# EAGLE design diplom (EAGLE 7.1.0)
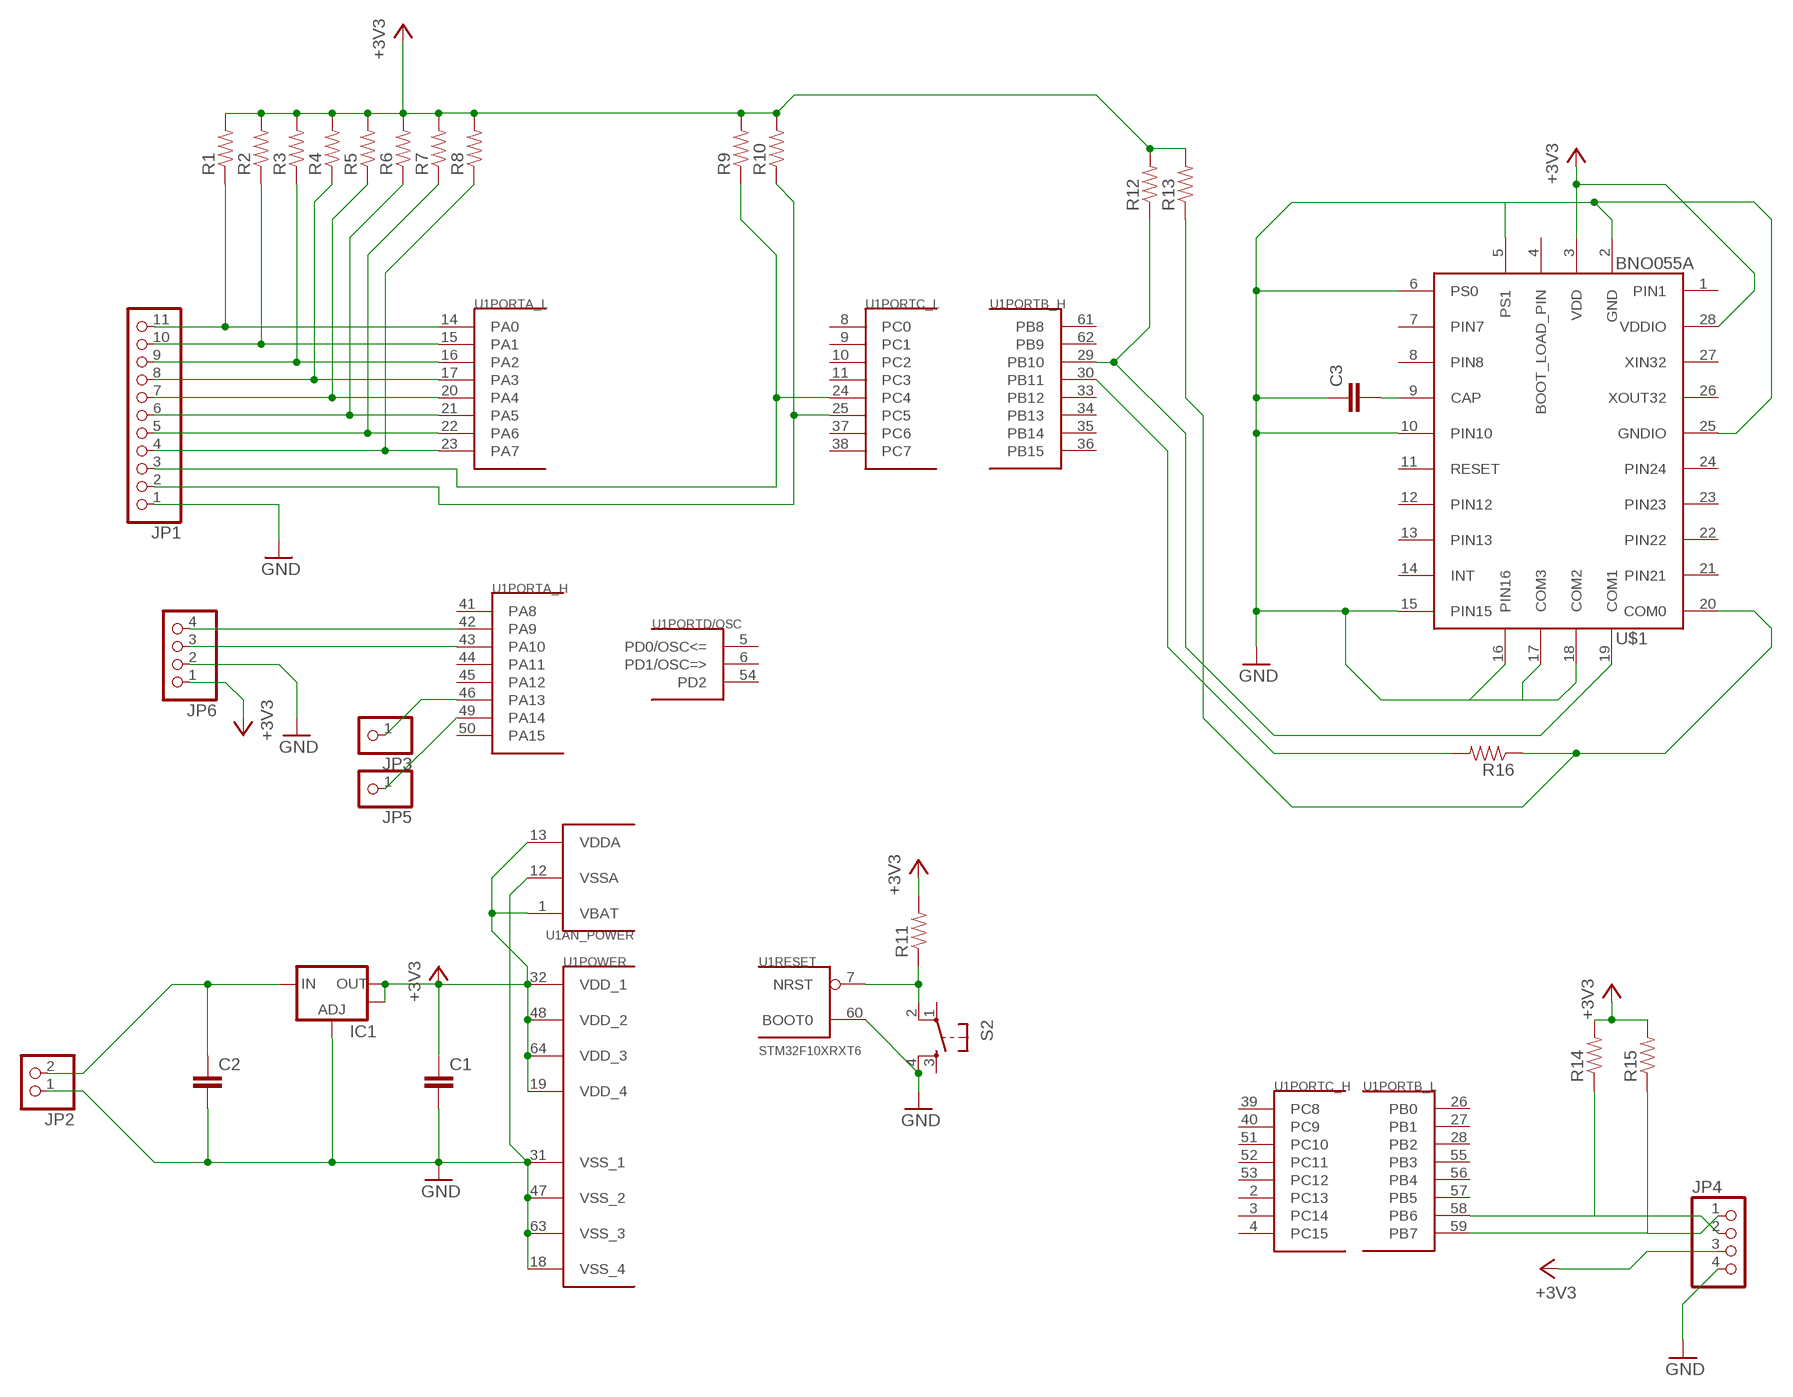
[diagram p0: schematic, sheet 1]

## Parts
C1  CAP1206  [1206]
C2  CAP1206  [1206]
C3  CAP1206  [1206]
IC1  V_REG_LM1117SOT223  [SOT223]
JP1  PINHD-1X11_2.54  [1X11]
JP2  PINHD-1X02_2.54  [1X02]
JP3  PINHD-1X01_2.54  [1X01]
JP4  PINHD-1X04_2.54  [1X04]
JP5  PINHD-1X01_2.54  [1X01]
JP6  PINHD-1X04_2.54  [1X04]
R1  RESISTOR1206  [1206]
R2  RESISTOR1206  [1206]
R3  RESISTOR1206  [1206]
R4  RESISTOR1206  [1206]
R5  RESISTOR1206  [1206]
R6  RESISTOR1206  [1206]
R7  RESISTOR1206  [1206]
R8  RESISTOR1206  [1206]
R9  RESISTOR1206  [1206]
R10  RESISTOR1206  [1206]
R11  RESISTOR1206  [1206]
R12  RESISTOR1206  [1206]
R13  RESISTOR1206  [1206]
R14  RESISTOR1206  [1206]
R15  RESISTOR1206  [1206]
R16  RESISTOR1206  [1206]
S2  TAC_SWITCHPTH  [TACTILE-PTH]
U1  STM32F10XRXT6  [TQFP64]
U$1  BNO055A  [BNO055]

## Nets
+3V3: C1.1 IC1.2(OUT) IC1.4(OUT) JP4.3 JP6.1 R1.2 R2.2 R3.2 R4.2 R5.2 R6.2 R7.2 R8.2 R9.2 R10.2 R11.2 R12.2 R13.2 R14.2 R15.2 U1.1(AN_POWER:VBAT) U1.13(AN_POWER:VDDA) U1.19(POWER:VDD_4) U1.32(POWER:VDD_1) U1.48(POWER:VDD_2) U1.64(POWER:VDD_3) U$1.3(VDD) U$1.28(VDDIO)
GND: C1.2 C2.2 C3.1 IC1.1(ADJ) JP1.1 JP2.1 JP4.4 JP6.2 S2.4 U1.12(AN_POWER:VSSA) U1.18(POWER:VSS_4) U1.31(POWER:VSS_1) U1.47(POWER:VSS_2) U1.60(RESET:BOOT0) U1.63(POWER:VSS_3) U$1.2(GND) U$1.5(PS1) U$1.6(PS0) U$1.10(PIN10) U$1.15(PIN15) U$1.16(PIN16) U$1.17(COM3) U$1.18(COM2) U$1.25(GNDIO)
N$1: JP3.1 U1.46(PORTA_H:PA13)
N$2: JP5.1 U1.49(PORTA_H:PA14)
N$3: JP1.11 R1.1 U1.14(PORTA_L:PA0)
N$4: JP1.10 R2.1 U1.15(PORTA_L:PA1)
N$5: JP1.9 R3.1 U1.16(PORTA_L:PA2)
N$6: JP1.8 R4.1 U1.17(PORTA_L:PA3)
N$7: JP1.7 R5.1 U1.20(PORTA_L:PA4)
N$8: JP1.6 R6.1 U1.21(PORTA_L:PA5)
N$9: JP1.5 R7.1 U1.22(PORTA_L:PA6)
N$10: JP1.4 R8.1 U1.23(PORTA_L:PA7)
N$11: JP1.3 R9.1 U1.24(PORTC_L:PC4)
N$12: JP1.2 R10.1 U1.25(PORTC_L:PC5)
N$13: R11.1 S2.2 U1.7(RESET:NRST)
N$14: C3.2 U$1.9(CAP)
N$15: JP4.2 R14.1 U1.58(PORTB_L:PB6)
N$16: R12.1 U1.29(PORTB_H:PB10) U$1.19(COM1)
N$17: R16.2 U1.30(PORTB_H:PB11)
N$18: C2.1 IC1.3(IN) JP2.2
N$19: JP4.1 R15.1 U1.59(PORTB_L:PB7)
N$21: R13.1 R16.1 U$1.20(COM0)
N$23: JP6.4 U1.42(PORTA_H:PA9)
N$24: JP6.3 U1.43(PORTA_H:PA10)
Unconnected: S2.1 S2.3 U1.2(PORTC_H:PC13) U1.3(PORTC_H:PC14) U1.4(PORTC_H:PC15) U1.5(PORTD/OSC:PD0/OSC<=) U1.6(PORTD/OSC:PD1/OSC=>) U1.8(PORTC_L:PC0) U1.9(PORTC_L:PC1) U1.10(PORTC_L:PC2) U1.11(PORTC_L:PC3) U1.26(PORTB_L:PB0) U1.27(PORTB_L:PB1) U1.28(PORTB_L:PB2) U1.33(PORTB_H:PB12) U1.34(PORTB_H:PB13) U1.35(PORTB_H:PB14) U1.36(PORTB_H:PB15) U1.37(PORTC_L:PC6) U1.38(PORTC_L:PC7) U1.39(PORTC_H:PC8) U1.40(PORTC_H:PC9) U1.41(PORTA_H:PA8) U1.44(PORTA_H:PA11) U1.45(PORTA_H:PA12) U1.50(PORTA_H:PA15) U1.51(PORTC_H:PC10) U1.52(PORTC_H:PC11) U1.53(PORTC_H:PC12) U1.54(PORTD/OSC:PD2) U1.55(PORTB_L:PB3) U1.56(PORTB_L:PB4) U1.57(PORTB_L:PB5) U1.61(PORTB_H:PB8) U1.62(PORTB_H:PB9) U$1.1(PIN1) U$1.4(BOOT_LOAD_PIN) U$1.7(PIN7) U$1.8(PIN8) U$1.11(RESET) U$1.12(PIN12) U$1.13(PIN13) U$1.14(INT) U$1.21(PIN21) U$1.22(PIN22) U$1.23(PIN23) U$1.24(PIN24) U$1.26(XOUT32) U$1.27(XIN32)

## Library data of the parts
C1-C3 = SparkFun:CAP: Capacitor Standard 0603 ceramic capacitor, and 0.1" leaded capacitor.
IC1 = SparkFun-3-2-07:V_REG_LM1117: Voltage Regulator LM1117 Standard adjustable voltage regulator but in SMD form. Spark Fun Electronics SKU : IC-LM1117
JP1 = pinhead-2:PINHD-1X11: PIN HEADER
JP2 = pinhead-2:PINHD-1X02: PIN HEADER
JP3 JP5 = pinhead-2:PINHD-1X01: PIN HEADER
JP4 JP6 = pinhead-2:PINHD-1X04: PIN HEADER
R1-R16 = SparkFun:RESISTOR: Resistor Basic schematic elements and footprints for 0603, 1206, and PTH resistors.
S2 = SparkFun-Electromechanical:TAC_SWITCH: Momentary Switch Button commonly used for reset or general input. Spark Fun Electronics SKU : COM-00097 SMT- SWCH-08247
U1 = stm32:STM32F10XRXT6: STM32F101/103 64pin LQFP
U$1 = BNO055:BNO055

## Board
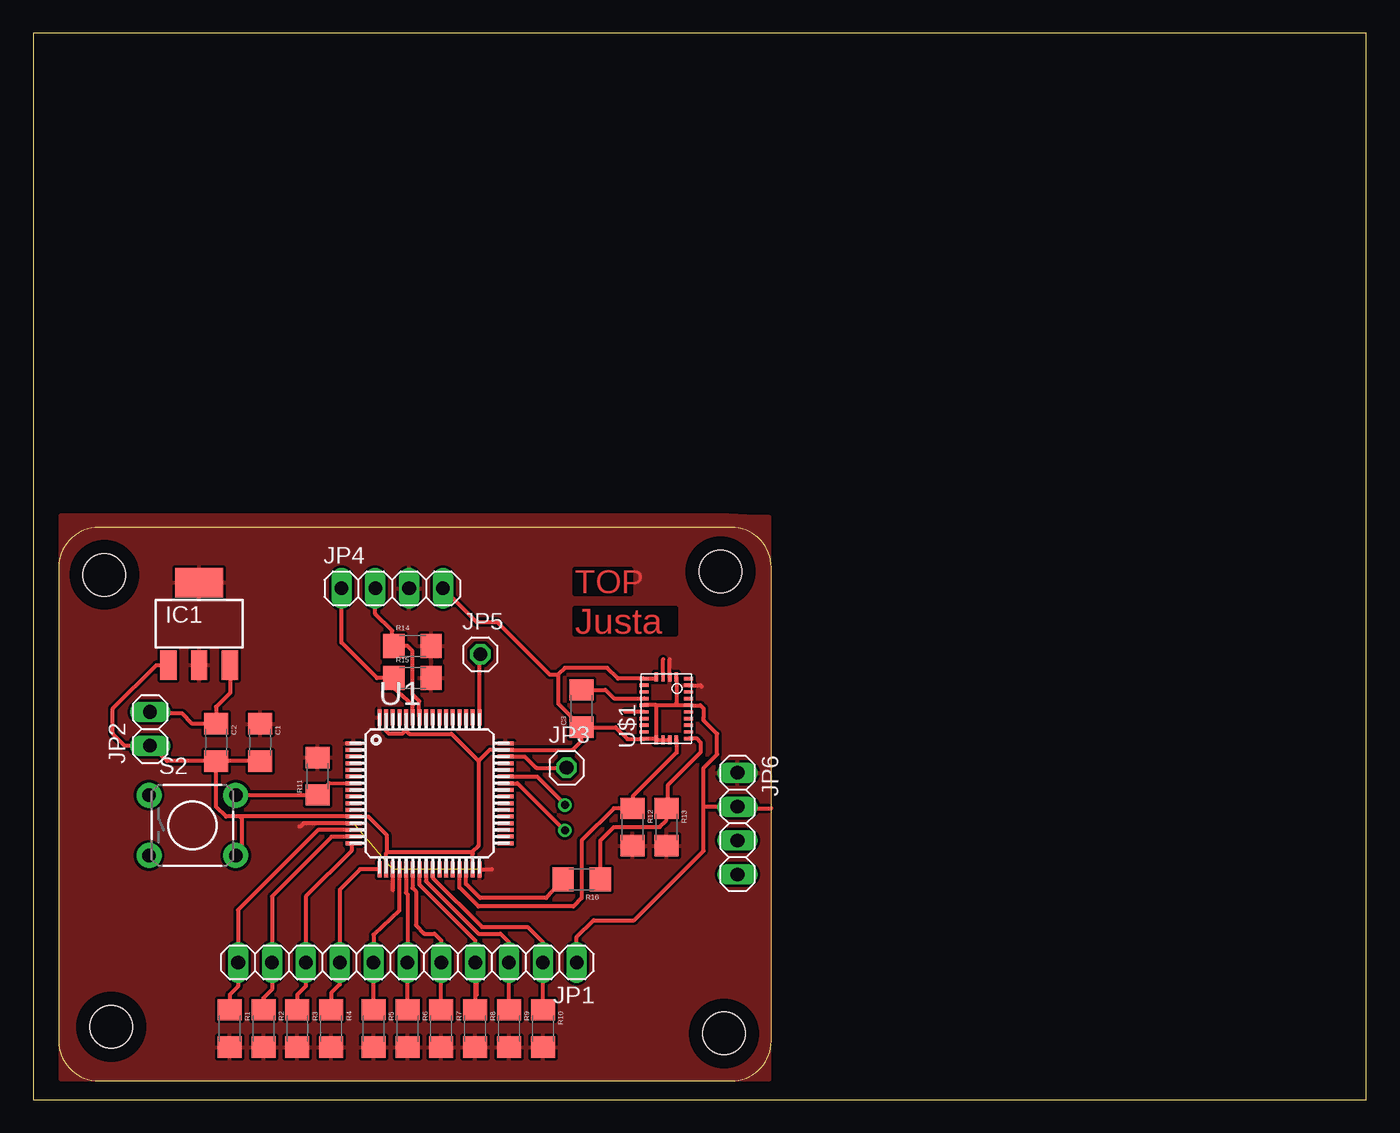
[diagram p1: board, top side]
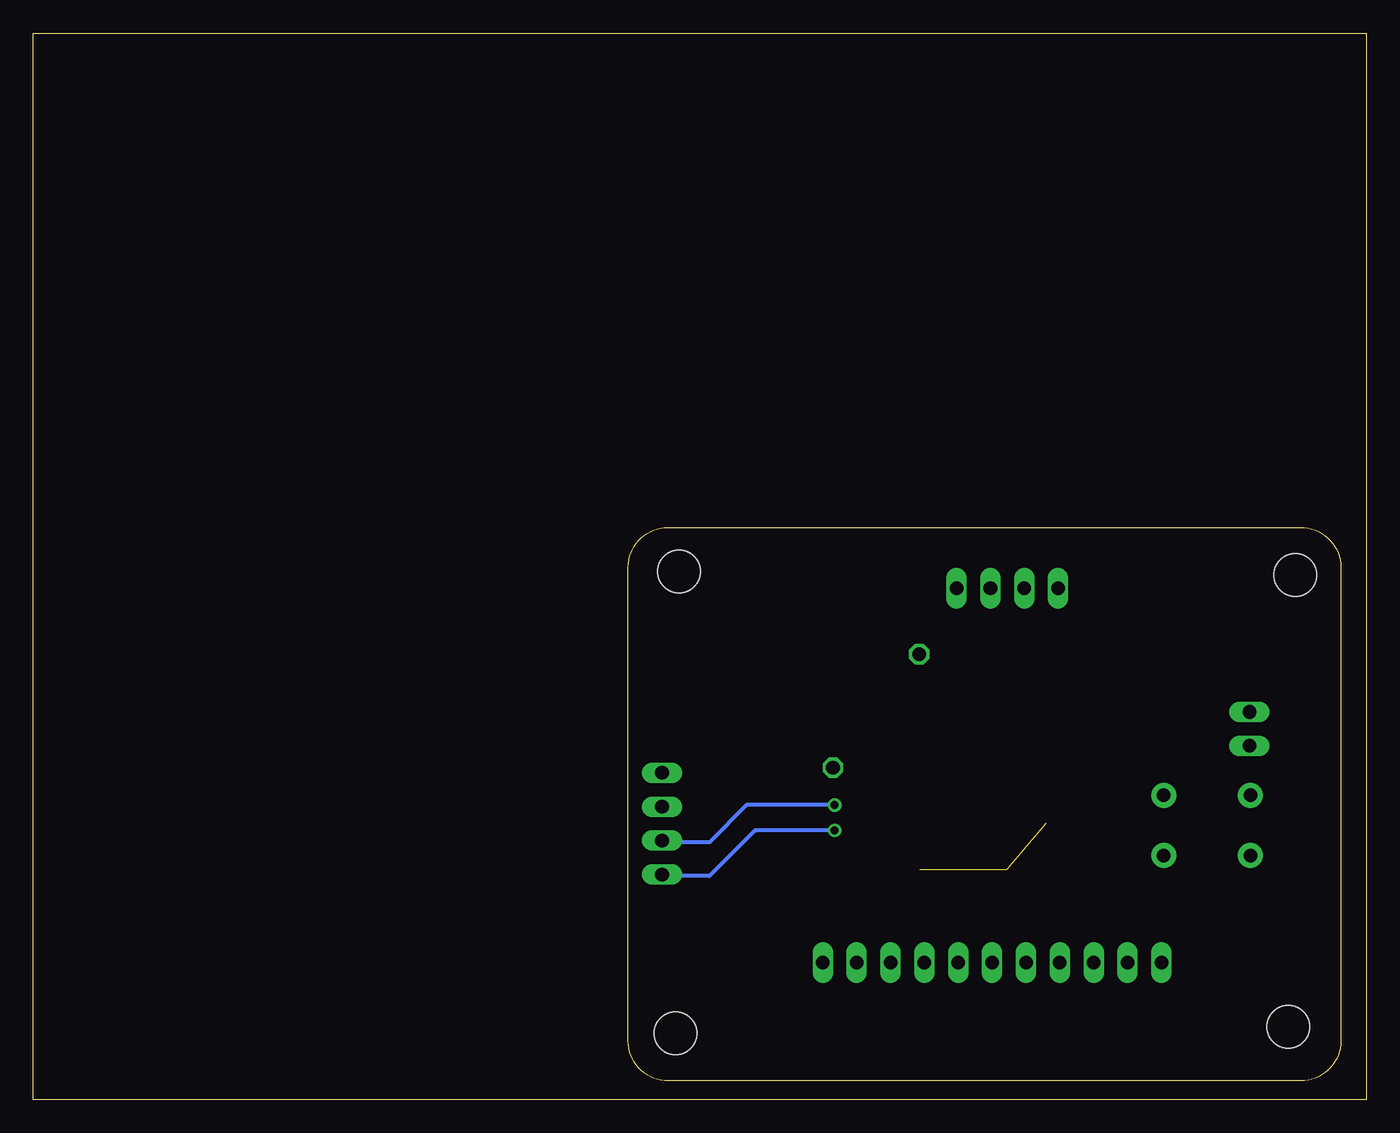
[diagram p2: board, bottom side, seen from below]

Size 100 x 80 mm. Coordinates in mm from the lower left corner, seen from the top.
Outline: 0,0 100,0 100,80 0,80 0,0
Copper layers (1*16): Top 0.035mm / dielectric 1mm / Bottom 0.035mm
Design rules "default *": minimum track width 10mil, minimum drill 24mil, track to track 0.2mm, track to pad 0.3mm, pad to pad 0.2mm, via to via 8mil, smd to smd 8mil, copper to edge 40mil, drill to drill 8mil, minimum pad ring 10mil, minimum via ring 8mil, stop-mask expansion 4mil, vias tented up to drill 0mil, thermal gap 10mil
Holes 3.2 mm at 5.84,5.46 51.56,39.62 5.33,39.37 51.82,4.95
Milling: 8 lines

### Footprints (pad centres in the part's own frame; a part is rotated, then mirrored left to right if it is on the bottom)
1206 = smd 1.6 x 1.8: 1 -1.4,0; 2 1.4,0
SOT223 = smd 1.219 x 2.235: 1 -2.311,-3.099; 2 0,-3.099; 3 2.311,-3.099 | smd 3.6 x 2.2: 4 0,3.099
1X11 = drill 1.016 long: 1 -12.7,0; 2 -10.16,0; 3 -7.62,0; 4 -5.08,0; 5 -2.54,0; 6 0,0; 7 2.54,0; 8 5.08,0; 9 7.62,0; 10 10.16,0; 11 12.7,0
1X02 = drill 1.016 long: 1 -1.27,0; 2 1.27,0
1X01 = drill 1.016 octagon: 1 0,0
1X04 = drill 1.016 long: 1 -3.81,0; 2 -1.27,0; 3 1.27,0; 4 3.81,0
TACTILE-PTH = drill 1.016 pad 1.88: 1 -3.251,2.261; 2 3.251,2.261; 3 -3.251,-2.261; 4 3.251,-2.261
TQFP64 = smd 1.2 x 0.3: 1 -5.7,3.75; 2 -5.7,3.25; 3 -5.7,2.75; 4 -5.7,2.25; 5 -5.7,1.75; 6 -5.7,1.25; 7 -5.7,0.75; 8 -5.7,0.25; 9 -5.7,-0.25; 10 -5.7,-0.75; 11 -5.7,-1.25; 12 -5.7,-1.75; 13 -5.7,-2.25; 14 -5.7,-2.75; 15 -5.7,-3.25; 16 -5.7,-3.75; 33 5.7,-3.75; 34 5.7,-3.25; 35 5.7,-2.75; 36 5.7,-2.25; 37 5.7,-1.75; 38 5.7,-1.25; 39 5.7,-0.75; 40 5.7,-0.25; 41 5.7,0.25; 42 5.7,0.75; 43 5.7,1.25; 44 5.7,1.75; 45 5.7,2.25; 46 5.7,2.75; 47 5.7,3.25; 48 5.7,3.75 | smd 0.3 x 1.2: 17 -3.75,-5.7; 18 -3.25,-5.7; 19 -2.75,-5.7; 20 -2.25,-5.7; 21 -1.75,-5.7; 22 -1.25,-5.7; 23 -0.75,-5.7; 24 -0.25,-5.7; 25 0.25,-5.7; 26 0.75,-5.7; 27 1.25,-5.7; 28 1.75,-5.7; 29 2.25,-5.7; 30 2.75,-5.7; 31 3.25,-5.7; 32 3.75,-5.7; 49 3.75,5.7; 50 3.25,5.7; 51 2.75,5.7; 52 2.25,5.7; 53 1.75,5.7; 54 1.25,5.7; 55 0.75,5.7; 56 0.25,5.7; 57 -0.25,5.7; 58 -0.75,5.7; 59 -1.25,5.7; 60 -1.75,5.7; 61 -2.25,5.7; 62 -2.75,5.7; 63 -3.25,5.7; 64 -3.75,5.7
BNO055 = smd 0.675 x 0.25: 1 1.663,2.25; 6 -1.665,2.25; 7 -1.665,1.75; 8 -1.665,1.25; 9 -1.665,0.75; 10 -1.665,0.25; 11 -1.665,-0.25; 12 -1.665,-0.75; 13 -1.665,-1.25; 14 -1.665,-1.75; 15 -1.665,-2.25; 20 1.663,-2.25; 21 1.663,-1.75; 22 1.663,-1.25; 23 1.663,-0.75; 24 1.663,-0.25; 25 1.663,0.25; 26 1.663,0.75; 27 1.663,1.25; 28 1.663,1.75 | smd 0.25 x 0.675: 2 0.75,2.362; 3 0.25,2.362; 4 -0.25,2.362; 5 -0.75,2.362; 16 -0.75,-2.362; 17 -0.25,-2.362; 18 0.25,-2.362; 19 0.75,-2.362

### Placement (x,y rotation side)
C1  17.02,26.8 270 top
C2  13.72,26.8 270 top
C3  41.15,29.34 90 top
IC1  12.45,35.69 0 top
JP1  28.07,10.29 180 top
JP2  8.76,27.81 90 top
JP3  40.01,24.89 0 top
JP4  26.92,38.35 0 top
JP5  33.53,33.4 0 top
JP6  52.83,20.7 270 top
R1  14.73,5.33 270 top
R2  17.27,5.33 270 top
R3  19.81,5.33 270 top
R4  22.35,5.33 270 top
R5  25.53,5.33 270 top
R6  28.07,5.33 270 top
R7  30.61,5.33 270 top
R8  33.15,5.33 270 top
R9  35.69,5.33 270 top
R10  38.23,5.33 270 top
R11  21.34,24.26 90 top
R12  44.96,20.45 270 top
R13  47.5,20.45 270 top
R14  28.45,34.04 0 top
R15  28.45,31.62 0 top
R16  41.15,16.51 180 top
S2  11.94,20.57 0 top
U1  29.72,22.99 0 top
U$1  47.5,29.34 0 top

### Tracks (layer width: path | path; a pad name or v marks a point on that pad's centre or on a via)
+3V3  (2 unrouted)
  Top 0.305: U1.32 33.48,17.27 34.42,17.27 | U1.19 26.98,15.7 | 19.96,20.47 20.02,20.47 20.27,20.73 24.01,20.73 U1.13 | U$1.28 50.07,31.09 50.16,30.99 | U$1.3 47.75,33.02
  pour Top: 2.29,43.56 2.29,1.52 55.24,1.52 55.24,43.56
GND
  Top 0.3: 49.41,29.59 50.04,29.59 50.29,29.34 50.29,28.7
  Top 0.305: U1.31 32.97,18.47 32.89,18.54 | 32.89,18.54 26.54,18.54 | U1.18 26.47,18.47 26.54,18.54 | 26.54,18.54 26.54,19.81 25.15,21.21 24.05,21.21 U1.12 15.49,21.24 | 33.4,25.4 34.24,26.24 U1.47 40.46,26.24 41.15,26.92 C3.1 | 33.4,25.4 33.4,19.05 32.89,18.54 | U1.60 27.97,27.71 | 27.97,27.71 27.69,27.43 26.67,27.43 26.67,27.46 26.47,27.66 U1.63 | 27.97,27.71 27.97,27.66 28.19,27.43 31.37,27.43 33.4,25.4 | C3.1 43.69,27.94 44.58,27.05 45.8,27.05 U$1.15 46.64,27.09 U$1.16 | U$1.16 46.75,29.58 46.74,29.59 | 46.74,29.59 U$1.10 | 39.37,31.88 39.88,32.38 43.05,32.38 43.85,31.59 U$1.6 46.64,31.59 U$1.5 | 39.37,31.88 39.37,29.71 C3.1 | 46.74,29.59 48.39,29.59 | 48.39,29.59 U$1.25 49.41,29.59 | U$1.2 48.25,29.73 48.39,29.59 | C1.2 C2.2 | C2.2 10.04,25.4 JP2.1 6.86,26.54 5.97,27.43 5.97,29.34 9.25,32.59 IC1.1 | 15.49,21.24 14.45,21.24 13.72,21.97 C2.2 | 15.49,21.24 15.62,21.11 15.62,18.75 S2.4 | JP1.1 40.77,12.19 42.04,13.46 45.09,13.46 50.29,18.67 50.29,21.97 | 50.29,21.97 50.29,24.89 51.31,25.91 51.31,27.43 50.29,28.45 50.29,28.7 | JP6.2 50.29,21.97 | U$1.16 U$1.17 U$1.18 | JP4.4 33.27,35.81 34.8,35.81 38.73,31.88 39.37,31.88
N$1
  Top 0.305: U1.46 36.87,25.74 37.72,24.89 JP3.1
N$2
  Top 0.305: U1.49 33.47,33.34 JP5.1
N$3
  Top 0.305: U1.14 24,20.22 21.36,20.22 15.37,14.22 JP1.11 15.37,8.51 14.73,7.87 R1.1
N$4
  Top 0.305: U1.15 23.99,19.71 22.38,19.71 17.91,15.24 JP1.10 17.91,8.26 17.27,7.62 R2.1
N$5
  Top 0.305: U1.16 23.88,19.09 23.88,18.67 20.45,15.24 JP1.9 20.45,8.51 19.81,7.87 R3.1
N$6
  Top 0.305: U1.17 25.95,17.27 24.51,17.27 22.99,15.75 JP1.8 22.99,8.64 22.35,8 R4.1
N$7
  Top 0.305: U1.20 27.46,17.28 27.46,14.17 25.53,12.37 JP1.7 R5.1
N$8
  Top 0.305: R6.1 JP1.6 28.07,15.42 27.96,15.52 U1.21
N$9
  Top 0.305: R7.1 JP1.5 30.61,11.94 30.1,12.45 29.34,12.45 28.7,13.08 28.7,15.62 28.45,15.88 28.45,17.27 U1.22
N$10
  Top 0.305: R8.1 33.15,9.14 33.27,7.87 33.27,10.16 JP1.4 33.15,11.94 28.96,16.13 28.96,17.27 U1.23
N$11
  Top 0.305: R9.1 JP1.3 35.69,11.81 35.05,12.45 33.4,12.45 29.46,16.38 U1.24
N$12
  Top 0.305: R10.1 JP1.2 38.23,11.81 37.08,12.95 33.66,12.95 29.97,16.64 U1.25
N$13
  Top 0.305: U1.7 22.23,23.75 R11.1 20.07,22.86 15.21,22.86 S2.2
N$14
  Top 0.305: C3.2 42.92,30.74 43.56,30.1 U$1.9
N$15
  Top 0.305: U1.58 28.96,28.7 28.96,29.9 28.45,30.4 28.45,33.66 28.07,34.04 R14.1 26.92,34.16 26.92,35.18 25.65,36.45 JP4.2
N$16
  Top 0.305: U$1.19 48.26,26.04 44.96,22.73 R12.1 43.56,21.84 41.15,19.43 41.15,15.11 40.51,14.48 33.4,14.48 31.97,15.91 U1.29
N$17
  Top 0.305: R16.2 38.48,15.11 33.53,15.11 32.47,16.17 U1.30
N$18
  Top 0.305: IC1.3 14.76,30.48 14.73,30.48 13.72,29.46 C2.1 11.94,28.2 11.18,28.96 8.89,28.96 JP2.2
N$19
  Top 0.305: U1.59 28.45,28.71 28.47,29.59 27.05,30.86 R15.1 25.78,31.62 23.11,34.29 JP4.1
N$20
  Top 0.305: 47.24,32 47.24,33.02
N$21
  Top 0.305: R16.1 42.55,19.43 43.56,20.45 46.99,20.45 47.5,20.95 R13.1 47.62,21.97 47.62,23.62 50.09,26.09 50.09,26.77 49.78,27.08 49.76,27.08 U$1.20
N$22
  pour Top: 2.03,43.81 2.03,1.52 55.24,1.52 55.24,43.69 54.23,43.69 52.2,43.81
N$23  (via drill 0.6)
  Top 0.305: U1.42 35.43,23.72 36.32,23.72 39.85,20.19 v39.88,20.19
  Bottom 0.305: v39.88,20.19 45.85,20.19 49.28,16.76 52.7,16.76 JP6.4
N$24  (via drill 0.6)
  Top 0.305: U1.43 37.8,24.23 39.88,22.15 v39.88,22.1
  Bottom 0.305: v39.88,22.1 46.48,22.1 49.28,19.3 52.7,19.3 JP6.3
N$25
  Top 0.305: 45.8,29.08 44.42,29.08
N$26
  Top 0.305: 52.83,21.84 55.37,21.84

### Text on the board
Top: TOP | Justa